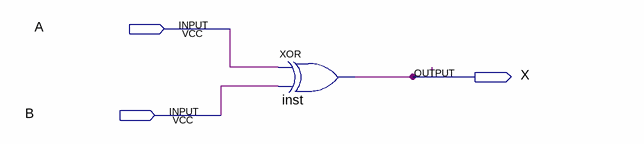
[diagram p0: schematic sheet]
// Quartus schematic Questao1b.bdf as structural Verilog: 1 symbols, 3 pins
module Questao1b (
  input  A,
  input  B,
  output X
);

  xor inst (X, A, B);
endmodule
